# Altium schematic sheet Control.SchDoc
size A3
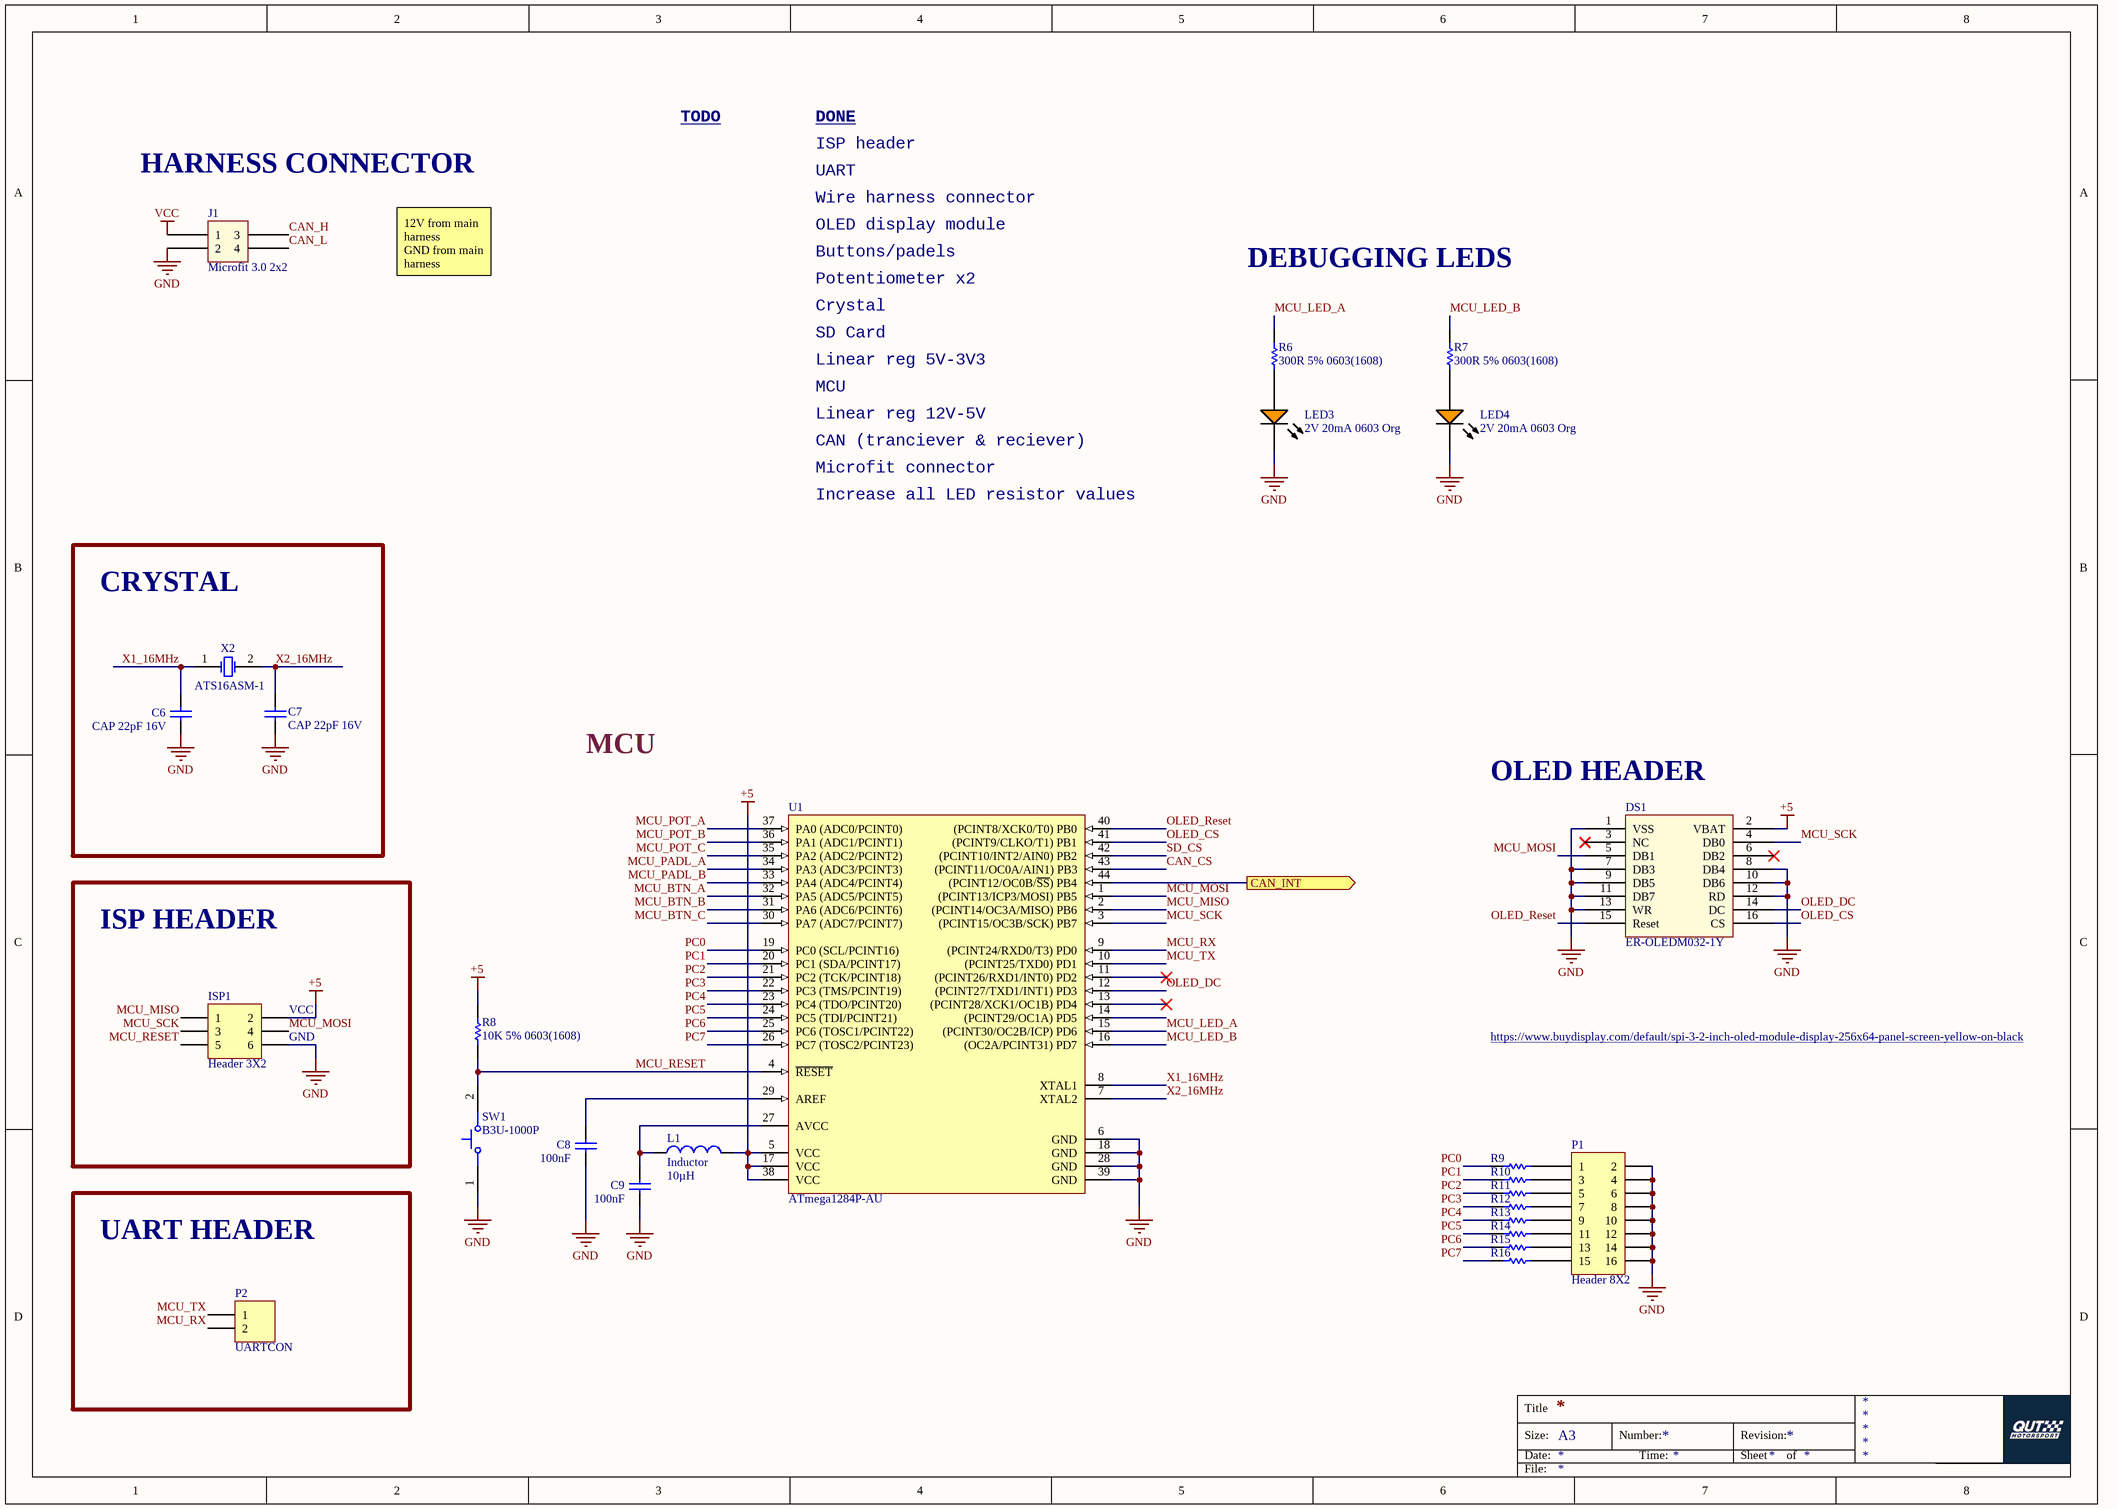
[diagram p0: Control.SchDoc]

## Parts
C6  CAP 22pF 16V  [CAPC0603(1608)100_N]
C7  CAP 22pF 16V  [CAPC0603(1608)100_N]
C8  100nF  [CAPC0603(1608)100_M]
C9  100nF  [CAPC0603(1608)100_M]
DS1  ER-OLEDM032-1Y  [ER-OLEDM032-1Y]
ISP1  Header 3X2  [HDR2X3]
J1  Microfit 3.0 2x2  [Microfit_2X2_R_TH]
L1  Inductor  value 10µH  [0603]
LED3  2V 20mA 0603 Org  [KING-LED0603-25-ORANGE_V]
LED4  2V 20mA 0603 Org  [KING-LED0603-25-ORANGE_V]
P1  Header 8X2  [HDR2X8]
P2  UARTCON  [HDR1X2]
R6  300R 5% 0603(1608)  [RESC0603(1608)_N]
R7  300R 5% 0603(1608)  [RESC0603(1608)_N]
R8  10K 5% 0603(1608)  [RESC0603(1608)_N]
R9  JMP  [RESC0603(1608)_N]  (value not drawn)
R10  JMP  [RESC0603(1608)_N]  (value not drawn)
R11  JMP  [RESC0603(1608)_N]  (value not drawn)
R12  JMP  [RESC0603(1608)_N]  (value not drawn)
R13  JMP  [RESC0603(1608)_N]  (value not drawn)
R14  JMP  [RESC0603(1608)_N]  (value not drawn)
R15  JMP  [RESC0603(1608)_N]  (value not drawn)
R16  (no value)  [RESC0603(1608)_N]
SW1  B3U-1000P  [OMRON-B3U-1000_V]
U1  ATmega1284P-AU  [44A_N]
X2  ATS16ASM-1  [CTS-ATS-SM-XTAL-2]

## Blocks framed on the sheet
CRYSTAL: C6 C7 X2
ISP HEADER: ISP1
UART HEADER: P2

## Ports
CAN_INT (out)

## Nets
+5: DS1.2(VBAT) ISP1.2 L1.2 R8.2 U1.5(VCC) U1.17(VCC) U1.38(VCC)
GND: C6.1 C7.2 C8.1 C9.1 DS1.1(VSS) DS1.7(DB3) DS1.8(DB4) DS1.9(DB5) DS1.10(DB6) DS1.11(DB7) DS1.12(RD) DS1.13(WR) ISP1.6 J1.2 LED3.2(K) LED4.2(K) P1.2 P1.4 P1.6 P1.8 P1.10 P1.12 P1.14 P1.16 SW1.1 U1.6(GND) U1.18(GND) U1.28(GND) U1.39(GND)
VCC: J1.1
CAN_CS: U1.43((PCINT11/OC0A/AIN1)_PB3)
CAN_H: J1.3
CAN_INT: U1.44((PCINT12/OC0B/~{SS})_PB4) ; port CAN_INT
CAN_L: J1.4
MCU_BTN_A: U1.32(PA5_(ADC5/PCINT5))
MCU_BTN_B: U1.31(PA6_(ADC6/PCINT6))
MCU_BTN_C: U1.30(PA7_(ADC7/PCINT7))
MCU_LED_A: R6.2 U1.15((PCINT30/OC2B/ICP)_PD6)
MCU_LED_B: R7.2 U1.16((OC2A/PCINT31)_PD7)
MCU_MISO: ISP1.1 U1.2((PCINT14/OC3A/MISO)_PB6)
MCU_MOSI: DS1.5(DB1) ISP1.4 U1.1((PCINT13/ICP3/MOSI)_PB5)
MCU_PADL_A: U1.34(PA3_(ADC3/PCINT3))
MCU_PADL_B: U1.33(PA4_(ADC4/PCINT4))
MCU_POT_A: U1.37(PA0_(ADC0/PCINT0))
MCU_POT_B: U1.36(PA1_(ADC1/PCINT1))
MCU_POT_C: U1.35(PA2_(ADC2/PCINT2))
MCU_RESET: ISP1.5 R8.1 SW1.2 U1.4(~{RESET})
MCU_RX: P2.2 U1.9((PCINT24/RXD0/T3)_PD0)
MCU_SCK: DS1.4(DB0) ISP1.3 U1.3((PCINT15/OC3B/SCK)_PB7)
MCU_TX: P2.1 U1.10((PCINT25/TXD0)_PD1)
OLED_CS: DS1.16(CS) U1.41((PCINT9/CLKO/T1)_PB1)
OLED_DC: DS1.14(DC) U1.12((PCINT27/TXD1/INT1)_PD3)
OLED_Reset: DS1.15(Reset) U1.40((PCINT8/XCK0/T0)_PB0)
PC0: R9.2 U1.19(PC0_(SCL/PCINT16))
PC1: R10.2 U1.20(PC1_(SDA/PCINT17))
PC2: R11.2 U1.21(PC2_(TCK/PCINT18))
PC3: R12.2 U1.22(PC3_(TMS/PCINT19))
PC4: R13.2 U1.23(PC4_(TDO/PCINT20))
PC5: R14.2 U1.24(PC5_(TDI/PCINT21))
PC6: R15.2 U1.25(PC6_(TOSC1/PCINT22))
PC7: R16.2 U1.26(PC7_(TOSC2/PCINT23))
SD_CS: U1.42((PCINT10/INT2/AIN0)_PB2)
X1_16MHz: C6.2 U1.8(XTAL1) X2.1(X1)
X2_16MHz: C7.1 U1.7(XTAL2) X2.2(X2)
NetC8_2: C8.2 U1.29(AREF)
NetC9_2: C9.2 L1.1 U1.27(AVCC)
NetLED3_1: LED3.1(A) R6.1
NetLED4_1: LED4.1(A) R7.1
NetP1_1: P1.1 R9.1
NetP1_3: P1.3 R10.1
NetP1_5: P1.5 R11.1
NetP1_7: P1.7 R12.1
NetP1_9: P1.9 R13.1
NetP1_11: P1.11 R14.1
NetP1_13: P1.13 R15.1
NetP1_15: P1.15 R16.1

Not connected (* = marked no-connect by the designer): DS1 3(NC)* 6(DB2)*; U1 11((PCINT26/RXD1/INT0)_PD2)* 13((PCINT28/XCK1/OC1B)_PD4)* 14((PCINT29/OC1A)_PD5)

## Notes on the sheet
- HARNESS CONNECTOR
- TODO
- ISP header
- DONE
- UART
- OLED display module
- Wire harness connector
- 12V from main harness
  GND from main harness
- Potentiometer x2
- Buttons/padels
- Crystal
- DEBUGGING LEDS
- SD Card
- Linear reg 5V-3V3
- Linear reg 12V-5V
- CAN (tranciever & reciever)
- MCU
- Microfit connector
- Increase all LED resistor values
- (near DS1) OLED HEADER
- (near ISP1) VCC
- (near ISP1) GND
- https://www.buydisplay.com/default/spi-3-2-inch-oled-module-display-256x64-panel-screen-yellow-on-black
- Title
- Size:
- Date:
- A3
- Number:
- Time:
- Revision:
- Sheet
- of
- File:

## Library data of the parts
C6 C7 = CMP-1035-00808-1: CAP 22pF 16V ±5% 0603 (1608 Metric) Thickness 1mm SMD; Tolerance: Â±5%; Case-EIA: 0603; Case-Metric: 1608; Technology: SMT; Value: 22pF; Rated Voltage: 16 V; Max Thickness: 1 mm
C8 C9 = CMP-1035-02583-1: CAP 100nF 16V ±5% 0603 (1608 Metric) Thickness 1mm SMD; Tolerance: Â±5%; Case-Metric: 1608; Case-EIA: 0603; Rated Voltage: 16 V; Max Thickness: 1 mm; Technology: SMT; Value: 100nF
DS1 = ER-OLEDM032-1Y: SPI 3.2 inch OLED Module Display 256x64 Panel Screen,Yellow on Black; ComponentLink1Description: BuyDisplay; ComponentLink1URL: https://www.buydisplay.com/default/spi-3-2-inch-oled-module-display-256x64-panel-screen-yellow-on-black
ISP1 = Header 3X2: Header, 3-Pin, Dual row; LatestRevisionDate: 17-Jul-2002; LatestRevisionNote: Re-released for DXP Platform.; Publisher: Altium Limited
J1 = Microfit_2x2
L1 = Inductor: Code_IEC: 1005; Published: 8-Jun-2000; LatestRevisionDate: 29-May-2009; LatestRevisionNote: IPC-7351 Footprint Added.; PackageReference: 0402-A; Publisher: Altium Limited; PackageDescription: Chip Inductor; Code_JEITA: 0402
LED3 LED4 = CMP-0239-00002-1: LED, SMT, 0603(1608), 0.25mm Tthickness, Super Bright Orange; PartNumber: APG1608SEKC/T; Forward Current: 30 mA; Power Dissipation: 75 mW; Reverse Voltage: 5 V; Packing: Reel; PackageDescription: 2-Pin SMT LED, 1.6 x 0.8 mm Body, 0.25mm Thickness; ComponentLink1URL: http://www.kingbrightusa.com/; PackageVersion: Rev. 4A, 12/2011; Storage Temperature: -40 to 85 degC; Mounting Technology: Surface Mount; ComponentLink2Description: Datasheet; DatasheetVersion: Rev. 4A, 12/2011; ComponentLink2URL: http://www.kingbrightusa.com/images/catalog/SPEC/APG1608SEKC-T.pdf; PackageReference: LED0603-25-ORANGE; ComponentLink1Description: Manufacturer URL
P1 = Header 8X2: Header, 8-Pin, Dual row; LatestRevisionDate: 17-Jul-2002; LatestRevisionNote: Re-released for DXP Platform.; Publisher: Altium Limited
P2 = Header 2: Header, 2-Pin; LatestRevisionDate: 17-Jul-2002; LatestRevisionNote: Re-released for DXP Platform.; Publisher: Altium Limited
R6 R7 R9-R16 = CMP-1012-00061-1: 300R 0.1W 5% 0603 (1608 Metric)  SMD; Case-EIA: 0603; Value: 300.00 Ohm; Case-Metric: 1608; Tolerance: 5 %; Power: 0.1 W; Technology: SMT
R8 = CMP-1012-00098-1: 10K 0.1W 5% 0603 (1608 Metric)  SMD; Case-EIA: 0603; Value: 10000.00 Ohm; Case-Metric: 1608; Technology: SMT; Tolerance: 5 %; Power: 0.1 W
SW1 = CMP-2100-03586-1: Ultra-Small Tactile Switch, 0.05 A, 12 V, -25 to 70 degC, 2-Pin SMD, RoHS, Tape and Reel; Manufacturer: Omron Electronic Components; Operating Force: 1.5N; Current Rating: 50mA; Voltage Rating (DC): 12V; Electrical Life: 200000Cycles; Actuator Length: 0.4mm; Insulation Resistance: 100MOhm; Switch Travel: 0.15mm; Throw Configuration: SPST; Illumination Type: Illuminated; Width: 3mm; Weight: 0.022g; Datasheet Version: 42005.0; Datasheet URL: http://www.omron.com/ecb/products/pdf/en-b3u.pdf; Height: 1.2mm; Package Quantity: 1; REACH SVHC: Unknown; Contact Current Rating: 50mA; Contact Material: Silver; Max Current Rating: 50mA; Package Reference: B3U-1000; Termination: SMD/SMT; Packaging: TapeandReel; Manufacturer URL: http://www.omron.com/; RoHSCompliant: true; Mount: SurfaceMount; Length: 4mm; Min Operating Temperature: -25degC; Depth: 2.5mm; Lead Free: LeadFree; Case/Package: SMD/SMT; Package Description: 2-Pin Surface Mount Device, Body 3 x 2.5 mm; Max Operating Temperature: 70degC; Orientation: Straight
U1 = CMP-0107-00053-1: 20 MHz 8-bit AVR Microcontroller with 128KB Flash, 44-Pin TQFP Pkg, Industrial Temp; PackageVersion: rev.B, Oct-2001; PackageReference: 44A; DatasheetVersion: revD, Nov-2009; PackageDescription: 44-Pin Plastic Thin Profile Quad Flat Pack, 10 x 10 x 1.0 mm Body, 0.8 mm Pitch (TQFP)
X2 = CMP-0585-00002-2: ATS-SM Series Quartz Crystal, 16 MHz, -20 to 70 degC, 11.1 x 4.83 x 4.3mm SMD, RoHS, Tape and Reel; Manufacturer: CTS Corporation; Shunt Capacitance (C0): 7.0 pF Max; Frequency: 16 MHz; Oscillation Mode: Fundamental or 3rd Overtone; Crystal Cut: AT-Cut; ESR Maximum: 40 Ohms; Drive Level (Type): 100 uW; PackageDescription: 2-Pin SMD, Body 11.1 x 4.83 mm, Pitch 8.5 mm; PackageReference: ATS-SM-XTAL-2; ComponentLink1URL: http://www.ctscorp.com/; PartNumber: ATS16ASM-1; RoHS: TRUE; ComponentLink1Description: Manufacturer URL; Operating Temperature: -20 to 70 degC; DatasheetVersion: Rev. K; ComponentLink2Description: Datasheet; Packing: Tape and Reel; ComponentLink2URL: http://www.ctscorp.com/components/Datasheets/008-0309-0.pdf; Mounting Technology: Surface Mount; ComponentLink3URL: http://www.ctscorp.com/components/Datasheets/008-0309-0.pdf; ComponentLink3Description: Package Specification